# Altium schematic sheet Analogue.SchDoc
size A3
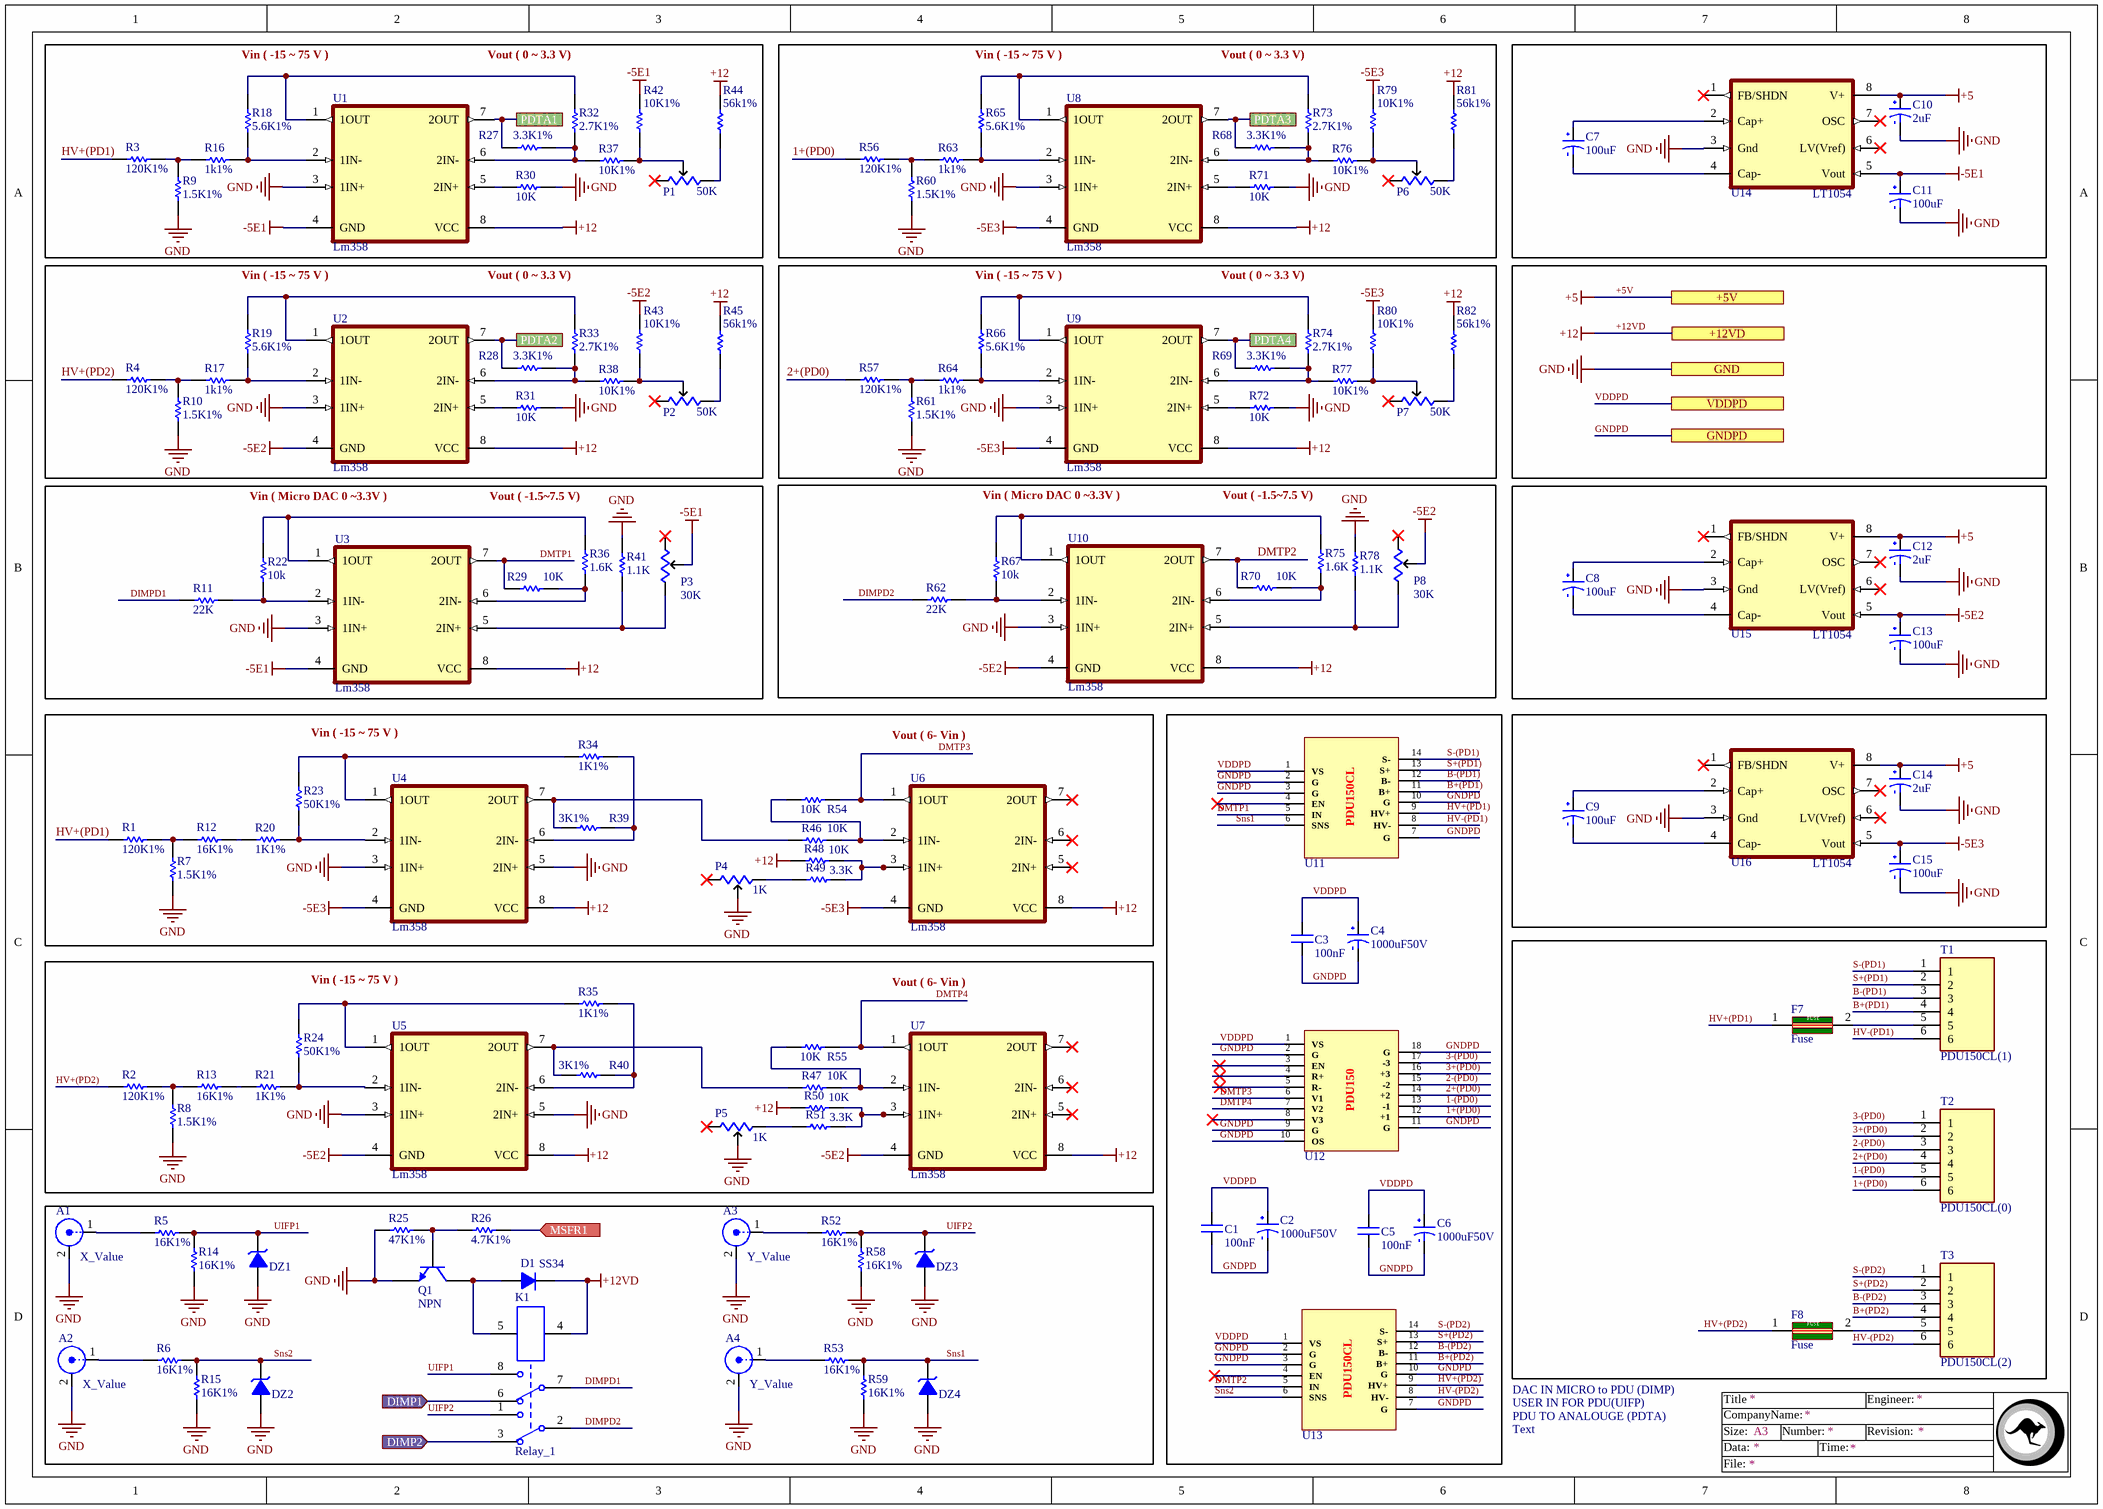
[diagram p0: Analogue.SchDoc]

## Parts
A1  X_Value  [SMA - R]
A2  X_Value  [SMA - R]
A3  Y_Value  [SMA - R]
A4  Y_Value  [SMA - R]
C1  100nF  [Cap0805]
C2  1000uF50V  [Cap_5mm]
C3  100nF  [Cap0805]
C4  1000uF50V  [Cap_5mm]
C5  100nF  [Cap0805]
C6  1000uF50V  [Cap_5mm]
C7  100uF  [CAPMOL_D]
C8  100uF  [CAPMOL_D]
C9  100uF  [CAPMOL_D]
C10  2uF  [CAPMOL_B]
C11  100uF  [CAPMOL_D]
C12  2uF  [CAPMOL_B]
C13  100uF  [CAPMOL_D]
C14  2uF  [CAPMOL_B]
C15  100uF  [CAPMOL_D]
D1  SS34  [Diod-1A-SMD]
DZ1  Diode Zener  [LL4148]  (value not drawn)
DZ2  Diode Zener  [LL4148]  (value not drawn)
DZ3  Diode Zener  [LL4148]  (value not drawn)
DZ4  Diode Zener  [LL4148]  (value not drawn)
F7  Fuse  [1206]
F8  Fuse  [1206]
K1  Relay_1  [Relay_1]
P1  50K  [Multi_tern]
P2  50K  [Multi_tern]
P3  30K  [Multi_tern]
P4  1K  [Multi_tern]
P5  1K  [Multi_tern]
P6  50K  [Multi_tern]
P7  50K  [Multi_tern]
P8  30K  [Multi_tern]
Q1  NPN  [SOT23_BEC_N]
R1  120K1%  [R0805]
R2  120K1%  [R0805]
R3  120K1%  [R0805]
R4  120K1%  [R0805]
R5  16K1%  [R0805]
R6  16K1%  [R0805]
R7  1.5K1%  [R0805]
R8  1.5K1%  [R0805]
R9  1.5K1%  [R0805]
R10  1.5K1%  [R0805]
R11  22K  [R0805]
R12  16K1%  [R0805]
R13  16K1%  [R0805]
R14  16K1%  [R0805]
R15  16K1%  [R0805]
R16  1k1%  [R0805]
R17  1k1%  [R0805]
R18  5.6K1%  [R0805]
R19  5.6K1%  [R0805]
R20  1K1%  [R0805]
R21  1K1%  [R0805]
R22  10k  [R0805]
R23  50K1%  [R0805]
R24  50K1%  [R0805]
R25  47K1%  [R0805]
R26  4.7K1%  [R0805]
R27  3.3K1%  [R0805]
R28  3.3K1%  [R0805]
R29  10K  [R0805]
R30  10K  [R0805]
R31  10K  [R0805]
R32  2.7K1%  [R0805]
R33  2.7K1%  [R0805]
R34  1K1%  [R0805]
R35  1K1%  [R0805]
R36  1.6K  [R0805]
R37  10K1%  [R0805]
R38  10K1%  [R0805]
R39  3K1%  [R0805]
R40  3K1%  [R0805]
R41  1.1K  [R0805]
R42  10K1%  [R0805]
R43  10K1%  [R0805]
R44  56k1%  [R0805]
R45  56k1%  [R0805]
R46  10K  [R0805]
R47  10K  [R0805]
R48  10K  [R0805]
R49  3.3K  [R0805]
R50  10K  [R0805]
R51  3.3K  [R0805]
R52  16K1%  [R0805]
R53  16K1%  [R0805]
R54  10K  [R0805]
R55  10K  [R0805]
R56  120K1%  [R0805]
R57  120K1%  [R0805]
R58  16K1%  [R0805]
R59  16K1%  [R0805]
R60  1.5K1%  [R0805]
R61  1.5K1%  [R0805]
R62  22K  [R0805]
R63  1k1%  [R0805]
R64  1k1%  [R0805]
R65  5.6K1%  [R0805]
R66  5.6K1%  [R0805]
R67  10k  [R0805]
R68  3.3K1%  [R0805]
R69  3.3K1%  [R0805]
R70  10K  [R0805]
R71  10K  [R0805]
R72  10K  [R0805]
R73  2.7K1%  [R0805]
R74  2.7K1%  [R0805]
R75  1.6K  [R0805]
R76  10K1%  [R0805]
R77  10K1%  [R0805]
R78  1.1K  [R0805]
R79  10K1%  [R0805]
R80  10K1%  [R0805]
R81  56k1%  [R0805]
R82  56k1%  [R0805]
T1  PDU150CL(1)  [SPOX6]
T2  PDU150CL(0)  [SPOX6]
T3  PDU150CL(2)  [SPOX6]
U1  Lm358  [SOIC127P600X175-8N]
U2  Lm358  [SOIC127P600X175-8N]
U3  Lm358  [SOIC127P600X175-8N]
U4  Lm358  [SOIC127P600X175-8N]
U5  Lm358  [SOIC127P600X175-8N]
U6  Lm358  [SOIC127P600X175-8N]
U7  Lm358  [SOIC127P600X175-8N]
U8  Lm358  [SOIC127P600X175-8N]
U9  Lm358  [SOIC127P600X175-8N]
U10  Lm358  [SOIC127P600X175-8N]
U11  PDU150CL  [PDU150CL]  (value not drawn)
U12  PDU150  [PDU150]  (value not drawn)
U13  PDU150CL  [PDU150CL]  (value not drawn)
U14  LT1054  [SOIC127P600X175-8N]
U15  LT1054  [SOIC127P600X175-8N]
U16  LT1054  [SOIC127P600X175-8N]

## Ports
+5V, +12VD, DIMP1 (in), DIMP2 (in), GND, GNDPD, MSFR1 (in), PDTA1, PDTA2, PDTA3, PDTA4, VDDPD

## Nets
+5V: C10.2 C12.2 C14.2 U14.8(V+) U15.8(V+) U16.8(V+) ; port +5V  [also labelled +5]
+12VD: D1.K K1.4 R44.1 R45.1 R48.1 R50.1 R81.1 R82.1 U1.8(VCC) U2.8(VCC) U3.8(VCC) U4.8(VCC) U5.8(VCC) U6.8(VCC) U7.8(VCC) U8.8(VCC) U9.8(VCC) U10.8(VCC) ; port +12VD  [also labelled +12]
-5E1: C11.2 P3.2 R42.1 U1.4(GND) U3.4(GND) U14.5(Vout)
-5E2: C13.2 P8.2 R43.1 U2.4(GND) U5.4(GND) U7.4(GND) U10.4(GND) U15.5(Vout)
-5E3: C15.2 R79.1 R80.1 U4.4(GND) U6.4(GND) U8.4(GND) U9.4(GND) U16.5(Vout)
GND: A1.2(Y) A2.2(Y) A3.2(Y) A4.2(Y) C10.1 C11.1 C12.1 C13.1 C14.1 C15.1 DZ1.A DZ2.A DZ3.A DZ4.A P4.2 P5.2 Q1.2(E) R7.1 R8.1 R9.1 R10.1 R14.1 R15.1 R25.2 R30.1 R31.1 R41.1 R58.1 R59.1 R60.1 R61.1 R71.1 R72.1 R78.1 U1.3(1IN+) U2.3(1IN+) U3.3(1IN+) U4.3(1IN+) U4.5(2IN+) U5.3(1IN+) U5.5(2IN+) U8.3(1IN+) U9.3(1IN+) U10.3(1IN+) U14.3(Gnd) U15.3(Gnd) U16.3(Gnd) ; port GND
1+(PD0): R56.2 T2.6 U12.12(+1)
1-(PD0): T2.5 U12.13(-1)
2+(PD0): R57.2 T2.4 U12.14(+2)
2-(PD0): T2.3 U12.15(-2)
3+(PD0): T2.2 U12.16(+3)
3-(PD0): T2.1 U12.17(-3)
B+(PD1): T1.4 U11.11(B+)
B+(PD2): T3.4 U13.11(B+)
B-(PD1): T1.3 U11.12(B-)
B-(PD2): T3.3 U13.12(B-)
DIMP1: K1.6 ; port DIMP1
DIMP2: K1.3 ; port DIMP2
DIMPD1: K1.7 R11.1
DIMPD2: K1.2 R62.1
DMTP1: R29.1 U3.7(2OUT) U11.5(IN)
DMTP2: R70.1 U10.7(2OUT) U13.5(IN)
DMTP3: R54.2 U6.1(1OUT) U12.6(V1)
DMTP4: R55.2 U7.1(1OUT) U12.7(V2)
GNDPD: C1.1 C2.1 C3.1 C4.1 C5.1 C6.1 U11.2(G) U11.3(G) U11.7(G) U11.10(G) U12.2(G) U12.9(G) U12.10(OS) U12.11(G) U12.18(G) U13.2(G) U13.3(G) U13.7(G) U13.10(G) ; port GNDPD
HV+(PD1): F7.1(IN) R1.1 R3.2 U11.9(HV+)
HV+(PD2): F8.1(IN) R2.1 R4.2 U13.9(HV+)
HV-(PD1): T1.6 U11.8(HV-)
HV-(PD2): T3.6 U13.8(HV-)
MSFR1: R26.1 ; port MSFR1
PDTA1: R27.1 U1.7(2OUT) ; port PDTA1
PDTA2: R28.1 U2.7(2OUT) ; port PDTA2
PDTA3: R68.1 U8.7(2OUT) ; port PDTA3
PDTA4: R69.1 U9.7(2OUT) ; port PDTA4
S+(PD1): T1.2 U11.13(S+)
S+(PD2): T3.2 U13.13(S+)
S-(PD1): T1.1 U11.14(S-)
S-(PD2): T3.1 U13.14(S-)
Sns1: DZ4.K R53.2 R59.2 U11.6(SNS)
Sns2: DZ2.K R6.2 R15.2 U13.6(SNS)
UIFP1: DZ1.K K1.8 R5.2 R14.2
UIFP2: DZ3.K K1.1 R52.2 R58.2
VDDPD: C1.2 C2.2 C3.2 C4.2 C5.2 C6.2 U11.1(VS) U12.1(VS) U13.1(VS) ; port VDDPD
NetA1_1: A1.1(X) R5.1
NetA2_1: A2.1(X) R6.1
NetA3_1: A3.1(X) R52.1
NetA4_1: A4.1(X) R53.1
NetC7_1: C7.1 U14.4(Cap-)
NetC7_2: C7.2 U14.2(Cap+)
NetC8_1: C8.1 U15.4(Cap-)
NetC8_2: C8.2 U15.2(Cap+)
NetC9_1: C9.1 U16.4(Cap-)
NetC9_2: C9.2 U16.2(Cap+)
NetD1_A: D1.A K1.5 Q1.3(C)
NetF7_2: F7.2(OUT) T1.5
NetF8_2: F8.2(OUT) T3.5
NetP1_2: P1.2 R37.1 R42.2
NetP1_3: P1.3 R44.2
NetP2_2: P2.2 R38.1 R43.2
NetP2_3: P2.3 R45.2
NetP3_3: P3.3 R41.2 U3.5(2IN+)
NetP4_1: P4.1 R49.1
NetP5_1: P5.1 R51.1
NetP6_2: P6.2 R76.1 R79.2
NetP6_3: P6.3 R81.2
NetP7_2: P7.2 R77.1 R80.2
NetP7_3: P7.3 R82.2
NetP8_3: P8.3 R78.2 U10.5(2IN+)
NetQ1_1: Q1.1(B) R25.1 R26.2
NetR1_2: R1.2 R7.2 R12.1
NetR2_2: R2.2 R8.2 R13.1
NetR3_1: R3.1 R9.2 R16.1
NetR4_1: R4.1 R10.2 R17.1
NetR11_2: R11.2 R22.2 U3.2(1IN-)
NetR12_2: R12.2 R20.1
NetR13_2: R13.2 R21.1
NetR16_2: R16.2 R18.2 U1.2(1IN-)
NetR17_2: R17.2 R19.2 U2.2(1IN-)
NetR18_1: R18.1 R32.1 U1.1(1OUT)
NetR19_1: R19.1 R33.1 U2.1(1OUT)
NetR20_2: R20.2 R23.2 U4.2(1IN-)
NetR21_2: R21.2 R24.2 U5.2(1IN-)
NetR22_1: R22.1 R36.1 U3.1(1OUT)
NetR23_1: R23.1 R34.1 U4.1(1OUT)
NetR24_1: R24.1 R35.1 U5.1(1OUT)
NetR27_2: R27.2 R32.2 R37.2 U1.6(2IN-)
NetR28_2: R28.2 R33.2 R38.2 U2.6(2IN-)
NetR29_2: R29.2 R36.2 U3.6(2IN-)
NetR30_2: R30.2 U1.5(2IN+)
NetR31_2: R31.2 U2.5(2IN+)
NetR34_2: R34.2 R39.2 U4.6(2IN-)
NetR35_2: R35.2 R40.2 U5.6(2IN-)
NetR39_1: R39.1 R46.1 U4.7(2OUT)
NetR40_1: R40.1 R47.1 U5.7(2OUT)
NetR46_2: R46.2 R54.1 U6.2(1IN-)
NetR47_2: R47.2 R55.1 U7.2(1IN-)
NetR48_2: R48.2 R49.2 U6.3(1IN+)
NetR50_2: R50.2 R51.2 U7.3(1IN+)
NetR56_1: R56.1 R60.2 R63.1
NetR57_1: R57.1 R61.2 R64.1
NetR62_2: R62.2 R67.2 U10.2(1IN-)
NetR63_2: R63.2 R65.2 U8.2(1IN-)
NetR64_2: R64.2 R66.2 U9.2(1IN-)
NetR65_1: R65.1 R73.1 U8.1(1OUT)
NetR66_1: R66.1 R74.1 U9.1(1OUT)
NetR67_1: R67.1 R75.1 U10.1(1OUT)
NetR68_2: R68.2 R73.2 R76.2 U8.6(2IN-)
NetR69_2: R69.2 R74.2 R77.2 U9.6(2IN-)
NetR70_2: R70.2 R75.2 U10.6(2IN-)
NetR71_2: R71.2 U8.5(2IN+)
NetR72_2: R72.2 U9.5(2IN+)

Not connected (* = marked no-connect by the designer): P1 1*; P2 1*; P3 1*; P4 3*; P5 3*; P6 1*; P7 1*; P8 1*; U6 5(2IN+)* 6(2IN-)* 7(2OUT)*; U7 5(2IN+)* 6(2IN-)* 7(2OUT)*; U11 4(EN)*; U12 3(EN)* 4(R+)* 5(R-)* 8(V3)*; U13 4(EN)*; U14 1(FB/SHDN)* 6(LV(Vref))* 7(OSC)*; U15 1(FB/SHDN)* 6(LV(Vref))* 7(OSC)*; U16 1(FB/SHDN)* 6(LV(Vref))* 7(OSC)*

## Notes on the sheet
- Vin ( -15 ~ 75 V )
- Vout ( 0 ~ 3.3 V)
- Vin ( Micro DAC 0 ~3.3V )
- Vout ( -1.5~7.5 V)
- Vout ( 6- Vin )
- DAC IN MICRO to PDU (DIMP)
- USER IN FOR PDU(UIFP)
- PDU TO ANALOUGE (PDTA)
- Text
- Title
- Size:
- Data:
- CompanyName:
- A3
- Number:
- Time:
- Revision:
- Engineer:
- File:
- (in symbol Fuse) FUSE

## Library data of the parts
A1-A4 = ANTENA: Antena MLF
C1 C3 C5 = Cap: Surface mount Capacitor
C2 C4 C6-C15 = Cap_P: Polarity
D1 = Diode
K1 = Relay_1: Relay
P1-P8 = POT: Potentiometer
Q1 = NPN: NPN Bipolar Transistor; Published: 8-Jun-2000; LatestRevisionDate: 29-May-2009; LatestRevisionNote: IPC-7351 Footprint Added.; PackageVersion: Aug-1999; PackageReference: SOT-23B; Publisher: Altium Limited; PackageDescription: 3-Pin SOT-23 Package 0.95 mm Pitch, 2.4 mm Lead Span
R1-R17 R20 R21 R25 R26 R52 R53 R56-R64 = Resistor: 30K
R18 R19 R22-R24 R27-R51 R54 R55 R65-R82 = Resistor
T1-T3 = SPOX 1*6
U14-U16 = LMC7660